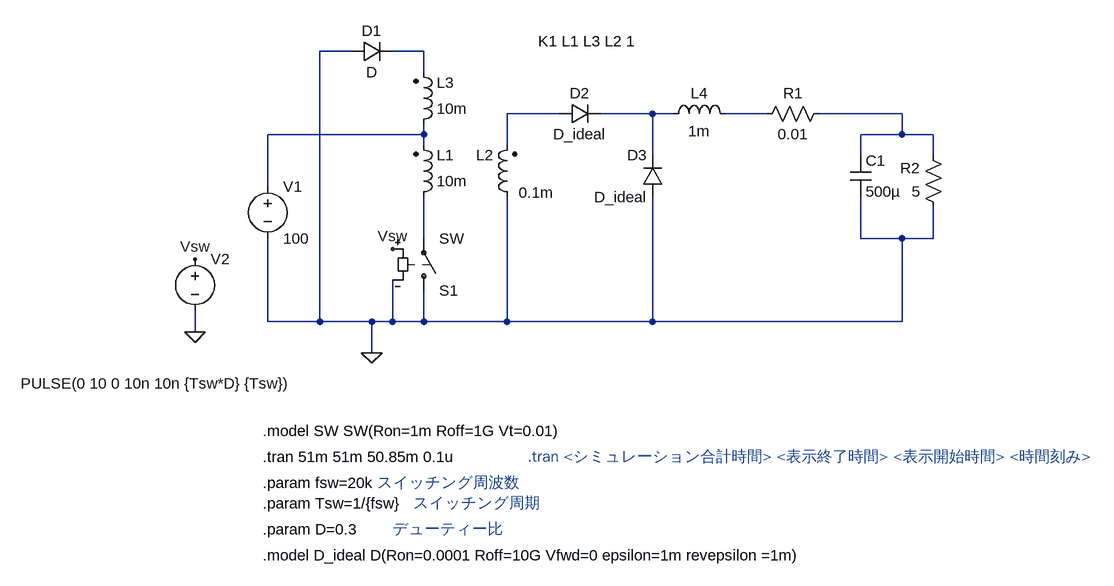
[diagram p0: schematic prof_10_foward_converter.asc]
prof_10_foward_converter.asc, the LTspice schematic file:
Version 4
SHEET 1 1264 928
WIRE 176 -16 128 -16
WIRE 288 -16 240 -16
WIRE 288 16 288 -16
WIRE 496 80 416 80
WIRE 640 80 560 80
WIRE 672 80 640 80
WIRE 816 80 752 80
WIRE 1024 80 896 80
WIRE 288 112 288 96
WIRE 288 112 48 112
WIRE 1024 112 1024 80
WIRE 1024 112 960 112
WIRE 1072 112 1024 112
WIRE 288 128 288 112
WIRE 416 128 416 80
WIRE 640 144 640 80
WIRE 960 144 960 112
WIRE 1072 144 1072 112
WIRE 48 192 48 112
WIRE 288 272 288 208
WIRE 960 272 960 208
WIRE 1024 272 960 272
WIRE 1072 272 1072 224
WIRE 1072 272 1024 272
WIRE 48 400 48 272
WIRE 128 400 128 -16
WIRE 128 400 48 400
WIRE 208 400 128 400
WIRE 240 400 240 336
WIRE 240 400 208 400
WIRE 288 400 288 352
WIRE 288 400 240 400
WIRE 416 400 416 208
WIRE 416 400 288 400
WIRE 640 400 640 208
WIRE 640 400 416 400
WIRE 1024 400 1024 272
WIRE 1024 400 640 400
WIRE -64 416 -64 384
WIRE 208 448 208 400
FLAG -64 416 0
FLAG -64 304 Vsw
FLAG 240 288 Vsw
FLAG 208 448 0
SYMBOL ind2 272 224 M180
WINDOW 0 36 80 Left 2
WINDOW 3 36 40 Left 2
SYMATTR InstName L1
SYMATTR Value 10m
SYMATTR SpiceLine Rser=0.001
SYMBOL ind2 432 224 R180
WINDOW 0 36 80 Left 2
WINDOW 3 -56 23 Left 2
SYMATTR InstName L2
SYMATTR Value 0.1m
SYMATTR SpiceLine Rser=0.001m
SYMBOL ind2 272 112 M180
WINDOW 0 36 80 Left 2
WINDOW 3 36 40 Left 2
SYMATTR InstName L3
SYMATTR Value 10m
SYMATTR SpiceLine Rser=0.001
SYMBOL sw 288 368 M180
SYMATTR InstName S1
SYMBOL voltage 48 176 R0
SYMATTR InstName V1
SYMATTR Value 100
SYMBOL diode 176 0 R270
WINDOW 0 32 32 VTop 2
WINDOW 3 0 32 VBottom 2
SYMATTR InstName D1
SYMBOL diode 496 96 R270
WINDOW 0 32 32 VTop 2
WINDOW 3 0 32 VBottom 2
SYMATTR InstName D2
SYMATTR Value D_ideal
SYMBOL diode 656 208 R180
WINDOW 0 24 64 Left 2
WINDOW 3 24 0 Left 2
SYMATTR InstName D3
SYMATTR Value D_ideal
SYMBOL ind 656 96 R270
WINDOW 0 32 56 VTop 2
WINDOW 3 5 56 VBottom 2
SYMATTR InstName L4
SYMATTR Value 1m
SYMBOL res 912 64 R90
WINDOW 0 0 56 VBottom 2
WINDOW 3 32 56 VTop 2
SYMATTR InstName R1
SYMATTR Value 0.01
SYMBOL res 1088 240 R180
WINDOW 0 36 76 Left 2
WINDOW 3 36 40 Left 2
SYMATTR InstName R2
SYMATTR Value 5
SYMBOL cap 944 144 R0
SYMATTR InstName C1
SYMATTR Value 500µ
SYMBOL voltage -64 288 R0
WINDOW 3 -268 207 Left 2
SYMATTR Value PULSE(0 10 0 10n 10n {Tsw*D} {Tsw})
SYMATTR InstName V2
TEXT 40 568 Left 2 !.model SW SW(Ron=1m Roff=1G Vt=0.01)
TEXT 40 608 Left 2 !.tran 51m 51m 50.85m 0.1u
TEXT 40 648 Left 2 !.param fsw=20k
TEXT 40 680 Left 2 !.param Tsw=1/{fsw}
TEXT 40 720 Left 2 !.param D=0.3
TEXT 240 720 Left 2 ;デューティー比
TEXT 272 680 Left 2 ;スイッチング周期
TEXT 216 648 Left 2 ;スイッチング周波数
TEXT 448 608 Left 2 ;.tran <シミュレーション合計時間> <表示終了時間> <表示開始時間> <時間刻み>
TEXT 40 760 Left 2 !.model D_ideal D(Ron=0.0001 Roff=10G Vfwd=0 epsilon=1m revepsilon =1m)
TEXT 464 -32 Left 2 !K1 L1 L3 L2 1

The netlist it stands for:
* prof_10_foward_converter.asc
L1 N007 N006 10m Rser=0.001
L2 0 N002 0.1m Rser=0.001m
L3 N006 N001 10m Rser=0.001
S1 0 N007 Vsw 0 SW
V1 N006 0 100
D1 0 N001 D
D2 N002 N003 D_ideal
D3 0 N003 D_ideal
L4 N003 N004 1m
R1 N005 N004 0.01
R2 0 N005 5
C1 N005 0 500µ
V2 Vsw 0 PULSE(0 10 0 10n 10n {Tsw*D} {Tsw})
.model D D
.lib standard.dio
.model SW SW(Ron=1m Roff=1G Vt=0.01)
.tran 51m 51m 50.85m 0.1u
.param fsw=20k
.param Tsw=1/{fsw}
.param D=0.3
* デューティー比
* スイッチング周期
* スイッチング周波数
* .tran <シミュレーション合計時間> <表示終了時間> <表示開始時間> <時間刻み>
.model D_ideal D(Ron=0.0001 Roff=10G Vfwd=0 epsilon=1m revepsilon =1m)
K1 L1 L3 L2 1
.backanno
.end